# Altium schematic sheet TKNTN.SchDoc
size A3; SheetNumber: 1; SheetTotal: 1
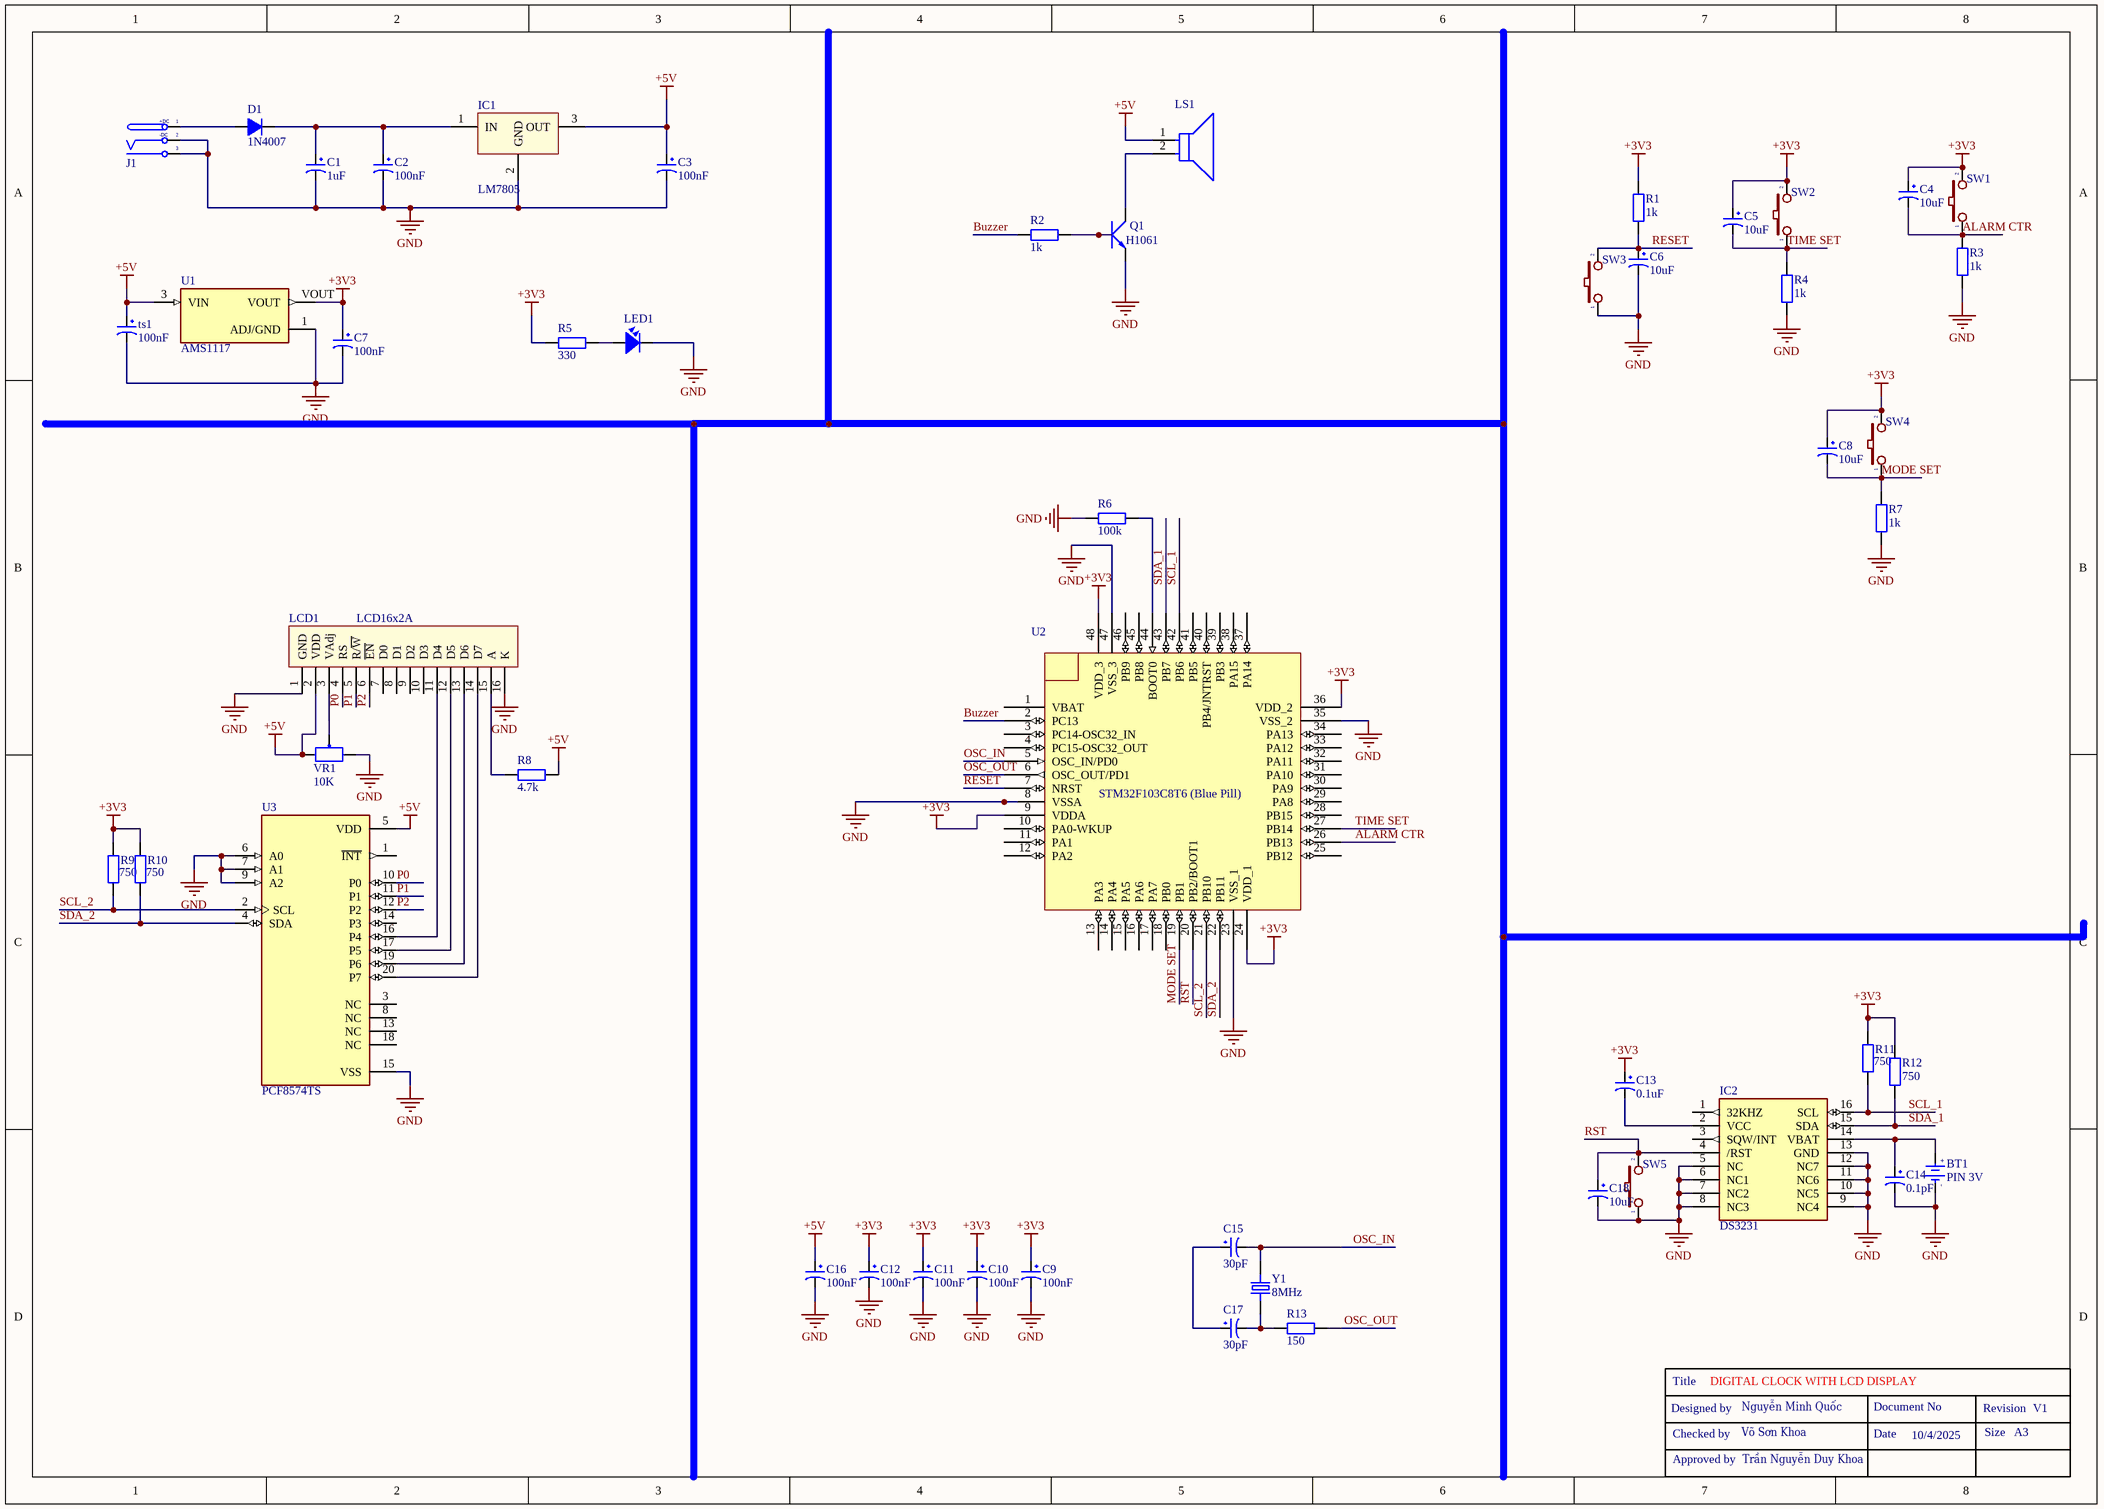
[diagram p0: TKNTN.SchDoc]

## Parts
*  Component_2  (value not drawn)
BT1  PIN 3V  [PIN3V]
C1  1uF  [CP1/2]
C2  100nF  [CP1/2]
C3  100nF  [CP1/2]
C4  10uF  [CP1/2]
C5  10uF  [CP1/2]
C6  10uF  [CP1/2]
C7  100nF  [CP1/2]
C8  10uF  [CP1/2]
C9  100nF  [CP1/2]
C10  100nF  [CP1/2]
C11  100nF  [CP1/2]
C12  100nF  [CP1/2]
C13  0.1uF  [CP1/2]
C14  0.1pF  [CP1/2]
C15  30pF  [CP1/2]
C16  100nF  [CP1/2]
C17  30pF  [CP1/2]
C18  10uF  [CP1/2]
D1  1N4007  [D1A]
IC1  LM7805  [QTO-220]
IC2  DS3231  [SO16W]  (value not drawn)
J1  JACK DC 5MM  [JACK DC 5MM]  (value not drawn)
LCD1  LCD16x2A  [LCD16X2]
LED1  LED  [LED-3]  (value not drawn)
LS1  PKM13EPYH4000-A0  [FP-PKM13EPYH4000-A0-MFG]  (value not drawn)
Q1  H1061  [QTO-220]
R1  1k  [R1/4W]
R2  1k  [R1/4W]
R3  1k  [R1/4W]
R4  1k  [R1/4W]
R5  330  [R1/4W]
R6  100k  [R1/4W]
R7  1k  [R1/4W]
R8  4.7k  [R1/4W]
R9  750  [R1/4W]
R10  750  [R1/4W]
R11  750  [R1/4W]
R12  750  [R1/4W]
R13  150  [R1/4W]
SW1  ALARM CTR  [SW2]  (value not drawn)
SW2  TIME SET  [SW2]  (value not drawn)
SW3  RESET  [SW2]  (value not drawn)
SW4  MODE SET  [SW2]  (value not drawn)
SW5  RST DS3221  [SW2]  (value not drawn)
ts1  100nF  [CP1/2]
U1  AMS1117  [SOT229P700X180-4N]
U2  STM32F103C8T6 (Blue Pill)  [STM32F103RC_TSQFP]
U3  PCF8574TS  [SOP65P640X150-20N]
VR1  10K  [VR]
Y1  8MHz  [XTAL_ECS-200-20-1X]

## Nets
+3V3: C4.1 C5.1 C7.1 C8.1 C9.1 C10.1 C11.1 C12.1 C13.1 R1.2 R5.1 R9.2 R10.2 R11.2 R12.2 SW1.2 SW2.2 SW4.2 U1.VOUT U2.9(VDDA) U2.24(VDD_1) U2.36(VDD_2) U2.48(VDD_3)
+5V: C3.1 C16.1 IC1.3(OUT) LCD1.2(VDD) LS1.1 R8.2 ts1.1 U1.3(VIN) U3.5(VDD) VR1.1
GND: BT1.2(GND) C1.2 C2.2 C3.2 C6.2 C7.2 C9.2 C10.2 C11.2 C12.2 C14.2 C16.2 C18.2 IC1.2(GND) IC2.5(NC) IC2.6(NC1) IC2.7(NC2) IC2.8(NC3) IC2.9(NC4) IC2.10(NC5) IC2.11(NC6) IC2.12(NC7) IC2.13(GND) J1.2(TN) J1.3(S) LCD1.1(GND) LCD1.16(K) LED1.2 Q1.3(E) R3.1 R4.1 R6.1 R7.1 SW3.1 SW5.1 ts1.2 U1.1(ADJ/GND) U2.8(VSSA) U2.23(VSS_1) U2.35(VSS_2) U2.47(VSS_3) U3.6(A0) U3.7(A1) U3.9(A2) U3.15(VSS) VR1.3
ALARM CTR: C4.2 R3.2 SW1.1 U2.26(PB13)
Buzzer: R2.1 U2.2(PC13)
MODE SET: C8.2 R7.2 SW4.1 U2.19(PB1)
OSC_IN: C15.2 U2.5(OSC_IN/PD0) Y1.2
OSC_OUT: R13.2 U2.6(OSC_OUT/PD1)
P0: LCD1.4(RS) U3.10(P0)
P1: LCD1.5(R/~{W}) U3.11(P1)
P2: LCD1.6(~{EN}) U3.12(P2)
RESET: C6.1 R1.1 SW3.2 U2.7(NRST)
RST: C18.1 IC2.4(/RST) SW5.2 U2.20(PB2/BOOT1)
SCL_1: IC2.16(SCL) R11.1 U2.42(PB6)
SCL_2: R9.1 U2.21(PB10) U3.2(SCL)
SDA_1: IC2.15(SDA) R12.1 U2.43(PB7)
SDA_2: R10.1 U2.22(PB11) U3.4(SDA)
TIME SET: C5.2 R4.2 SW2.1 U2.27(PB14)
NetBT1_1: BT1.1(+3V) C14.1 IC2.14(VBAT)
NetC1_1: C1.1 C2.1 D1.2(K) IC1.1(IN)
NetC13_2: C13.2 IC2.2(VCC)
NetC15_1: C15.1 C17.1
NetC17_2: C17.2 R13.1 Y1.1
NetD1_1: D1.1(A) J1.1(T)
NetLCD1_3: LCD1.3(VAdj) VR1.2
NetLCD1_11: LCD1.11(D4) U3.16(P4)
NetLCD1_12: LCD1.12(D5) U3.17(P5)
NetLCD1_13: LCD1.13(D6) U3.19(P6)
NetLCD1_14: LCD1.14(D7) U3.20(P7)
NetLCD1_15: LCD1.15(A) R8.1
NetLED1_1: LED1.1 R5.2
NetLS1_2: LS1.2 Q1.2(C)
NetQ1_1: Q1.1(B) R2.2
NetR6_2: R6.2 U2.44(BOOT0)

Not connected (* = marked no-connect by the designer): IC2 1(32KHZ) 3(SQW/INT); LCD1 7(D0) 8(D1) 9(D2) 10(D3); U2 1(VBAT) 3(PC14-OSC32_IN) 4(PC15-OSC32_OUT) 10(PA0-WKUP) 11(PA1) 12(PA2) 13(PA3) 14(PA4) 15(PA5) 16(PA6) 17(PA7) 18(PB0) 25(PB12) 28(PB15) 29(PA8) 30(PA9) 31(PA10) 32(PA11) 33(PA12) 34(PA13) 37(PA14) 38(PA15) 39(PB3) 40(PB4/JNTRST) 41(PB5) 45(PB8) 46(PB9); U3 1(~{INT}) 3(NC) 8(NC) 13(NC) 14(P3) 18(NC)

## Notes on the sheet
- Title
- DIGITAL CLOCK WITH LCD DISPLAY
- Designed by
- (near *) Checked by
- (near *) Approved by
- Nguyễn Minh Quốc
- Võ Sơn Khoa
- Trần Nguyễn Duy Khoa
- Document No
- Date
- 10/4/2025
- Revision
- Size
- A3
- V1
- (in symbol JACK DC 5MM) +DC; -DC
- (in symbol PIN 3V) +; -

## Library data of the parts
BT1 = PIN 3V: Battery 3VDC; Value: PIN 3V
C1-C18 ts1 = CP1: Cap P  0,1uF < 22uF , 16 - 50V; Value: 10uF/50V; Description 1: 10 => 220uF/6,3V/10V - 10uF => 100uF/16V; Description 2: 0,1uF => 33uF/50V - 10uF => 22uF/63V; Description 3: 0,47uF => 10uF/100V
D1 = D1A: Diode 1A; Value: 1N4007
IC1 = LM78xx: On ap +, from + 5 to + 24VDC; Value: LM7805
IC2 = DS3231: Real Time Clock (RTC) IC Clock/Calendar - IÂ²C, 2-Wire Serial 8-SOIC (0.154, 3.90mm Width); MF: Maxim Integrated; Check_prices: https://www.snapeda.com/parts/DS3231/Maxim+Integrated/view-part/?ref=eda; Value: *; Availability: In Stock; MP: DS3231; Price: None; Package: SOIC-16 Maxim Integrated; SnapEDA_Link: https://www.snapeda.com/parts/DS3231/Maxim+Integrated/view-part/?ref=snap; Purchase-URL: https://pricing.snapeda.com/search/part/DS3231/?ref=eda
LCD1 = LCD16x2: LCD dipslay 16 char, 2 line; Value: LCD16x2A
LED1 = LED: LED Single colour Green and Red; Value: LED 3 ly Single Colour
LS1 = CMP-06202-000019-1: AUDIO PIEZO TRANSDUCER 30V TH; Washable: No; Max Frequency: 4kHz; Max Supply Voltage: 25V; Nominal Input Voltage: 3V; Capacitance: 5.5nF; Lead Free: Lead Free; Radiation Hardening: No; Max Operating Temperature: 85°C; Height: 6.9mm; Mount: Through Hole; Voltage Rating: 3V; Diameter: 12.6mm; Self Resonant Frequency: 4kHz; Packaging: Bulk; REACH SVHC: No SVHC; Package Quantity: 500; Min Operating Temperature: -40°C; Frequency: 4kHz; Voltage Rating (DC): 30V; Termination: Solder
Q1 = NPN_BCE: P 1W, BCE; Value: TIP41
R1-R13 = R1/4W: Resistor 1/4W; Value: R1/4W - 1K
SW1-SW5 = SW2: Switch button 2 pin; Value: SW chip 2 pin
U1 = AMS1117: 1A LOW DROPOUT VOLTAGE REGULATOR SOT-223; MF: Advanced Monolithic Systems; SnapEDA_Link: https://www.snapeda.com/parts/AMS1117/Advanced+Monolithic+Systems/view-part/?ref=snap; Package: SOT-223 Seeed Technology; Value: *; MP: AMS1117; Check_prices: https://www.snapeda.com/parts/AMS1117/Advanced+Monolithic+Systems/view-part/?ref=eda
U2 = STM32F103xx_LQFP48: STM32 ARM-based 32-bit MCU with 64 Kbytes Flash, 48-pin LQFP, Industrial Temperature; Published: 30-May-2008; DatasheetVersion: rev6, Mar-2008; PackageVersion: Mar-2008; PackageReference: LQFP48; Publisher: Altium Limited; PackageDescription: 48-Pin Low-Profile Quad Flat Pack, 7 x 7 mm Body, 0.5 mm Pitch (LQFP48); ComponentLink1Description: Manufacturer Link; ComponentLink1URL: www.st.com/stm32; ComponentLink2Description: Datasheet; ComponentLink2URL: http://www.st.com/stonline/products/literature/ds/13587.pdf
U3 = PCF8574TS: I/O Expander 8 IÂ²C 100 kHz 20-SSOP; MF: NXP USA; Package: SSOP-20 NXP Semiconductors; Price: None; Value: *; SnapEDA_Link: https://www.snapeda.com/parts/PCF8574TS/NXP+USA+Inc./view-part/?ref=snap; MP: PCF8574TS; Availability: Not in stock; Check_prices: https://www.snapeda.com/parts/PCF8574TS/NXP+USA+Inc./view-part/?ref=eda
VR1 = VR: Var Resistor; Value: VR 10K
Y1 = ECS-240.0001-18-1X: Crystals / Oscillators / Resonators 24.00014MHz 18pF; MF: ECS International; SnapEDA_Link: https://www.snapeda.com/parts/ECS-240.0001-18-1X/ECS/view-part/?ref=snap; Package: HC49/U ECS International; Value: *; MP: ECS-240.0001-18-1X; Check_prices: https://www.snapeda.com/parts/ECS-240.0001-18-1X/ECS/view-part/?ref=eda